# EAGLE design headstage-64-coax-adapter (EAGLE 8.3.2)
DESIGNER: Jon Newman; DESIGN_NAME: Headstage-64 Coax Adapter; LICENSE: CERN OHL v1.2; REVISION: 1.1
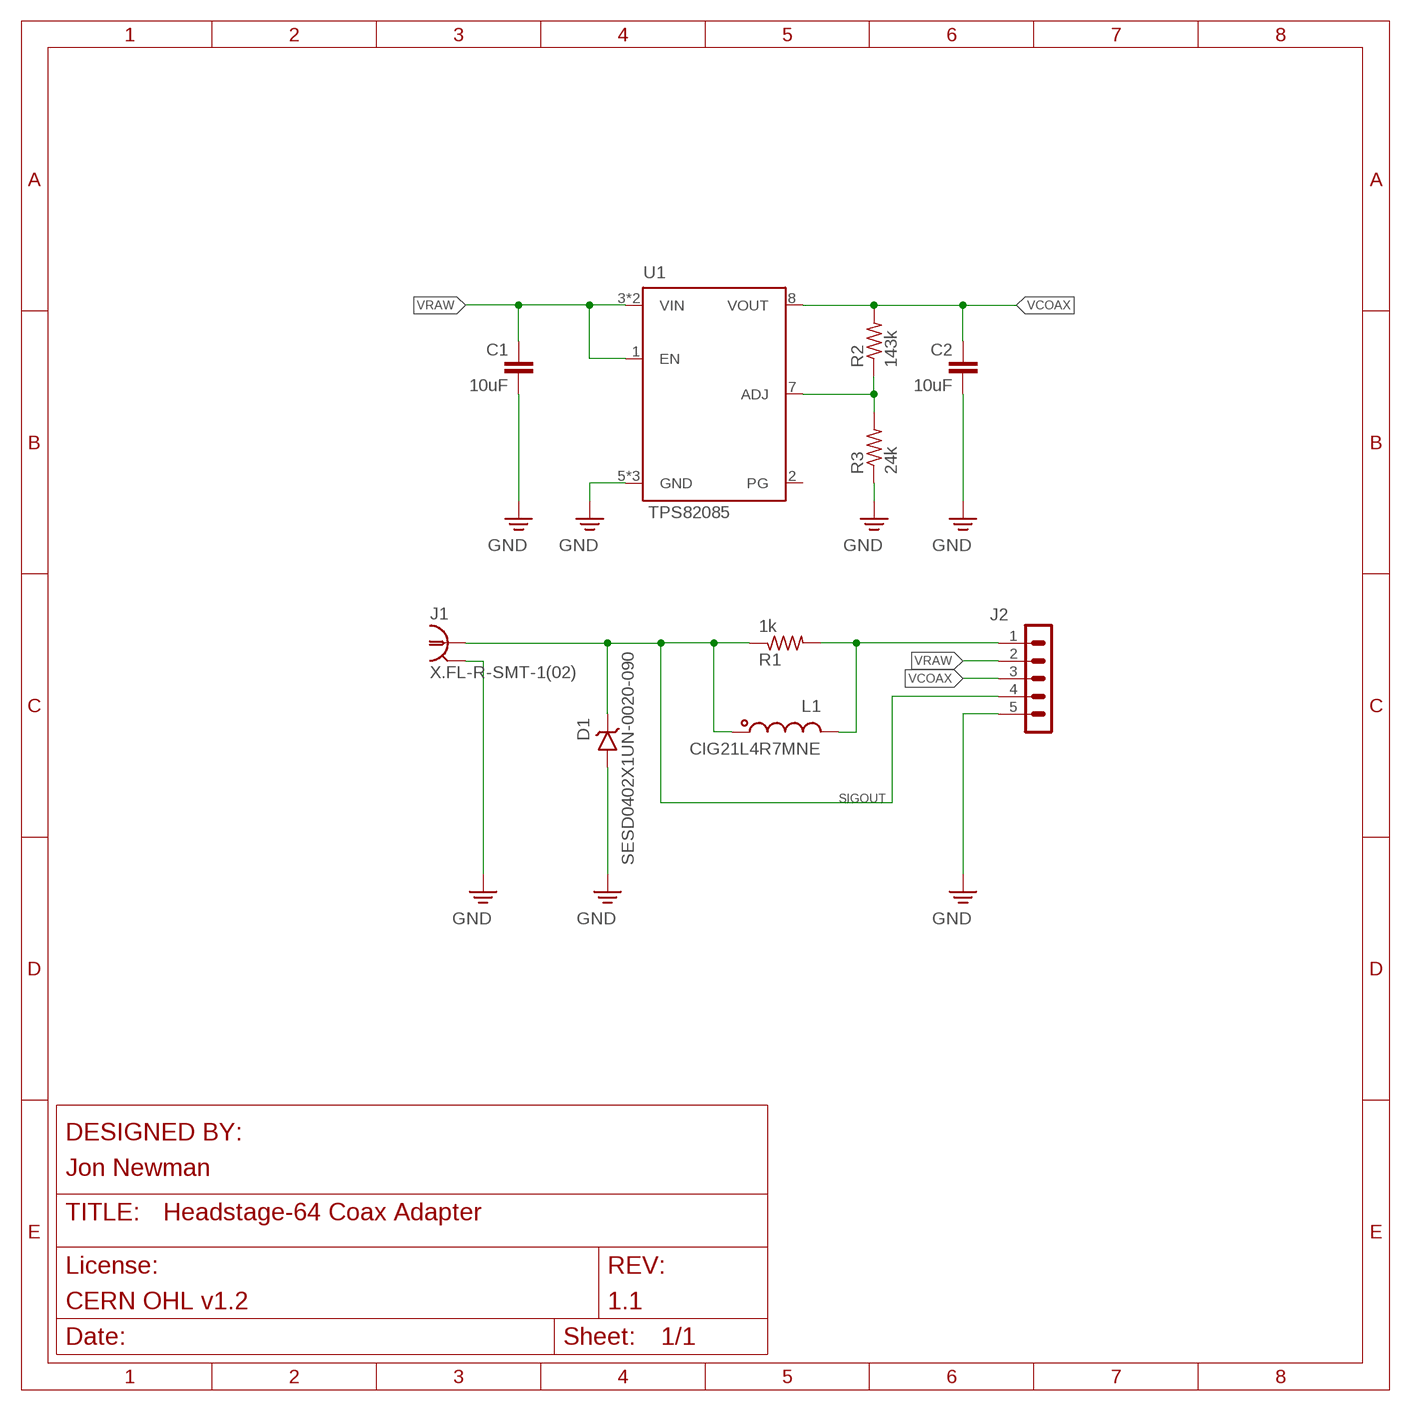
[diagram p0: schematic, sheet 1]

## Parts
C1  10uF  C_0402T  [0402T]
C2  10uF  C_0402T  [0402T]
D1  SESD0402X1UN-0020-090  Z-DIODE_0402T-DFN  [0402T-DFN]
J1  X.FL-R-SMT-1(02)  COAX_XFL  [X_FL_R_SMT_1(02)]
J2  PINHD-1X5_HEADSTAGE-64-REV1.4-DAUGHTER-CARD-CASTELLATED  [HEADSTAGE-64-REV1.4-DAUGHTER-CARD-CASTELLATED]
L1  CIG21L4R7MNE  L_0805T  [0805T]
R1  1k  R_0201T  [0201T]
R2  143k  R_0201T  [0201T]
R3  24k  R_0201T  [0201T]
U1  TPS82085  TPS8208X  [MICROSIP9-2.8X3]

## Nets
GND: C1.2 C2.2 D1.A J1.P$2 J1.P$3 J1.P$4 J2.5 R3.1 U1.5(GND) U1.6(GND) U1.PAD(GND)
N$2: R2.1 R3.2 U1.7(ADJ)
N$48: J2.1 L1.2 R1.2
SIGOUT: D1.C J1.P$1 J2.4 L1.1 R1.1
VCOAX: C2.1 J2.3 R2.2 U1.8(VOUT)
VRAW: C1.1 J2.2 U1.1(EN) U1.3(VIN) U1.4(VIN)
Unconnected: U1.2(PG)

## Library data of the parts
C1 C2 = jonnew:C: Capacitor; PARTNO: CL05A475MO5NUNC
D1 = jonnew:Z-DIODE: Zener Diode
J1 = jonnew:COAX: COAX CONNECTOR - Edge mount BNC - Vertical BNC - Vertical SMA - etc
J2 = jonnew:PINHD-1X5
L1 = jonnew:L: Inductor
R1-R3 = jonnew:R: Resistor
U1 = jonnew:TPS8208X

## Board
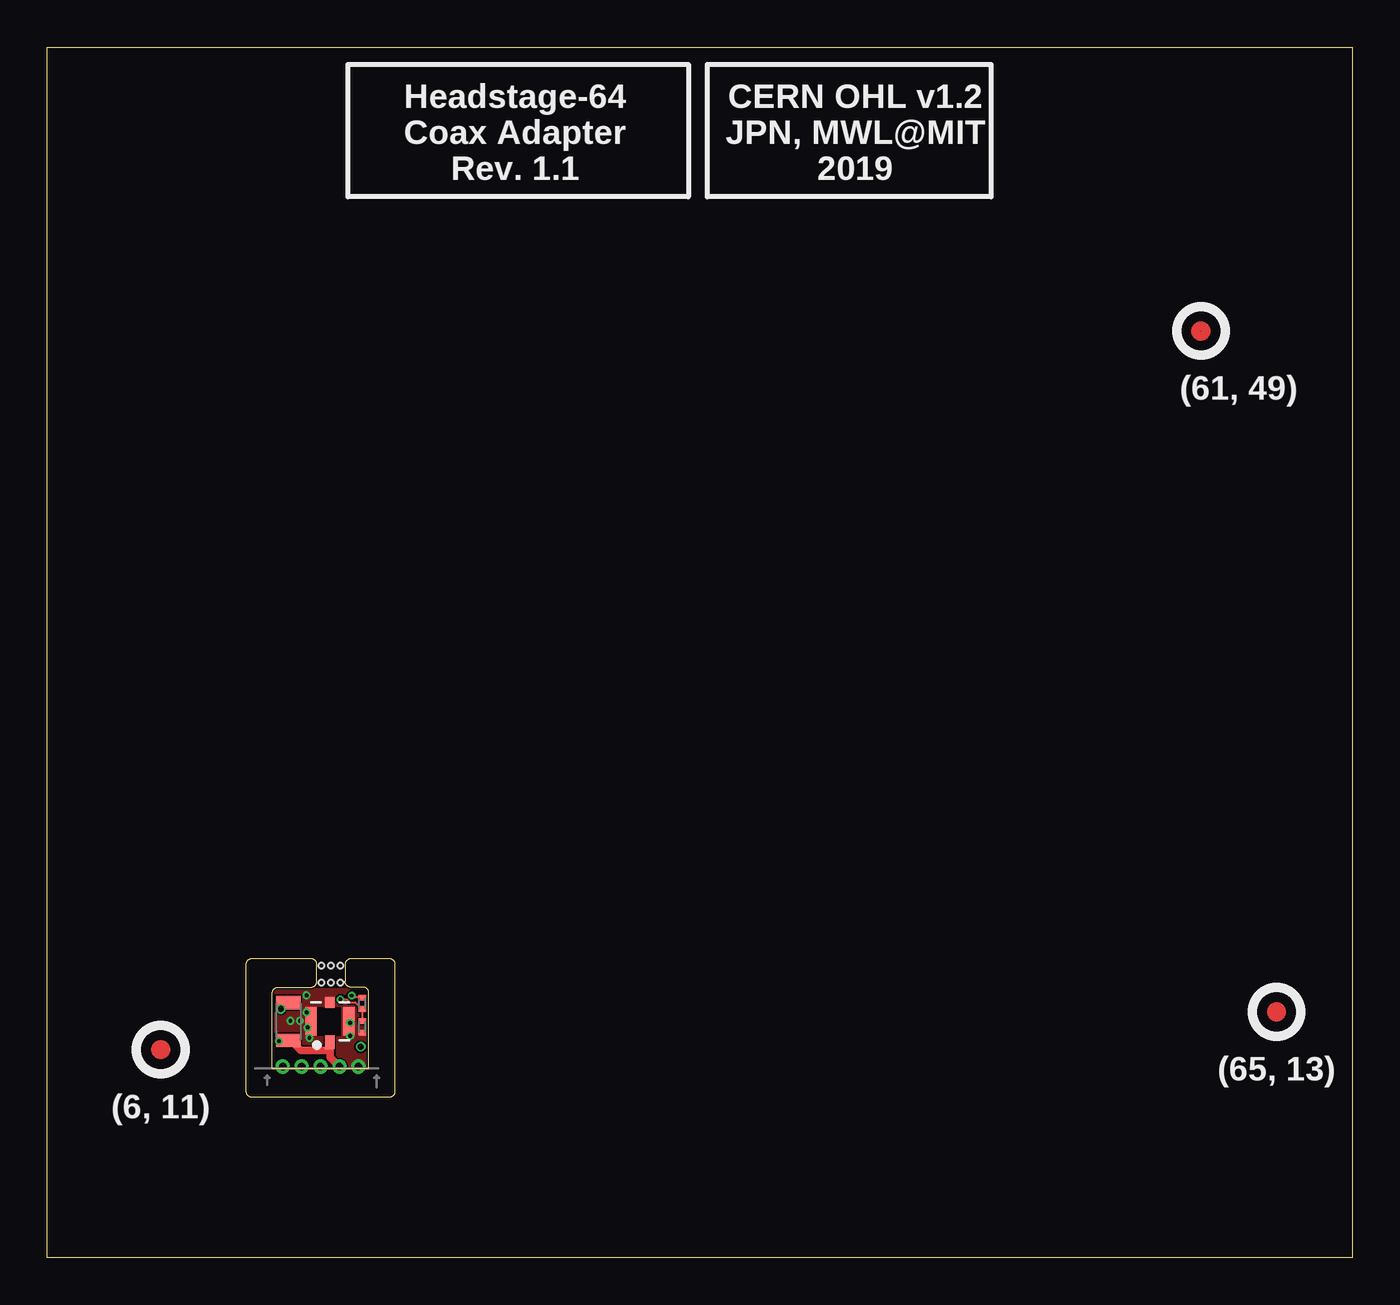
[diagram p1: board, top side]
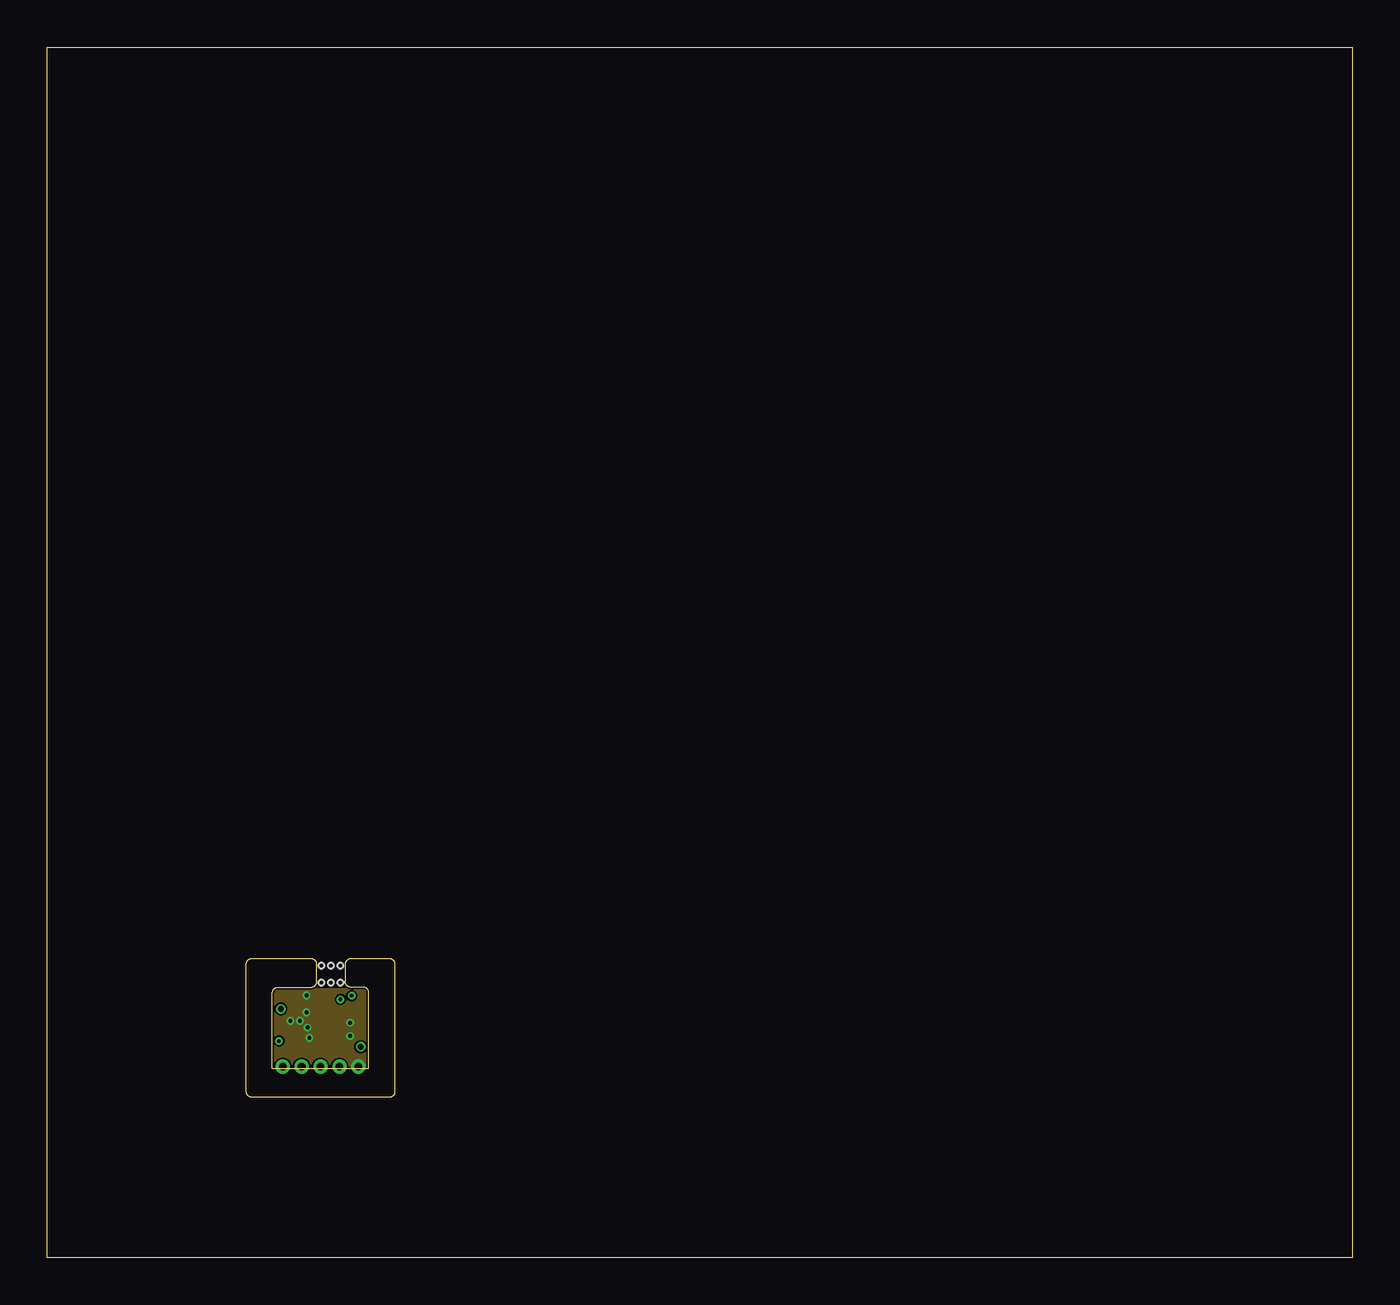
[diagram p2: board, inner layer Route2]
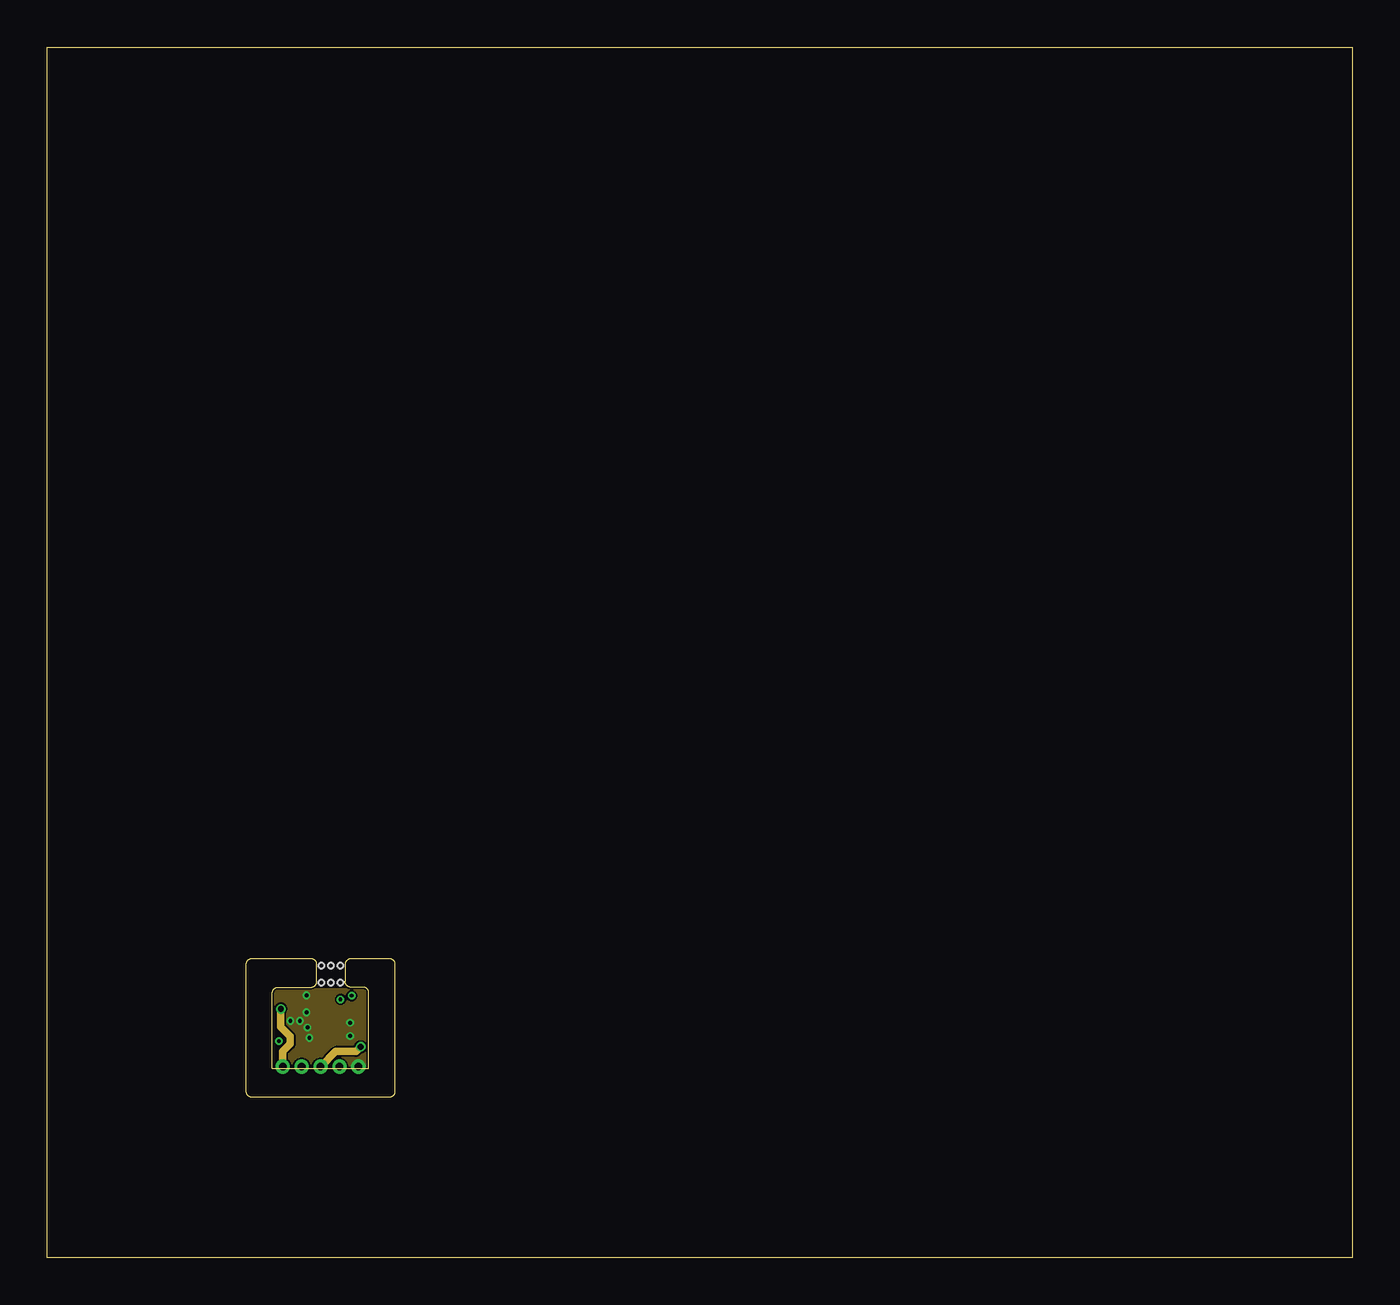
[diagram p3: board, inner layer Route15]
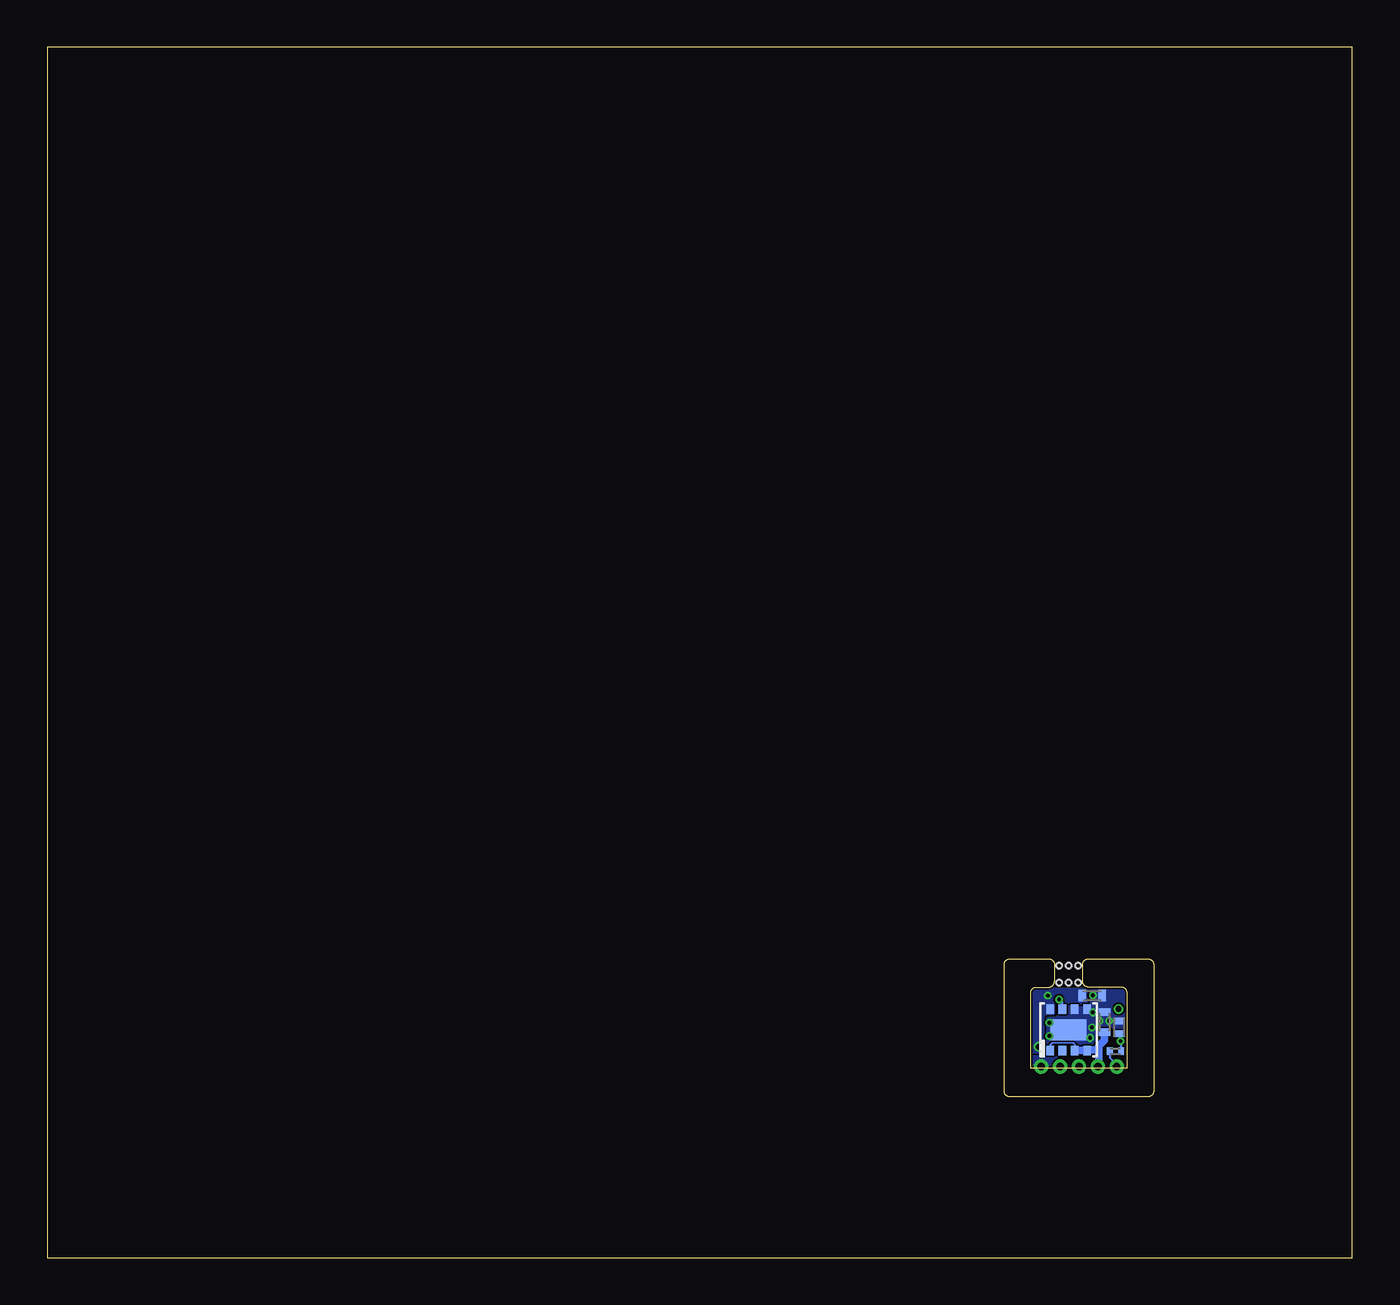
[diagram p4: board, bottom side, seen from below]

Size 69 x 64 mm. Coordinates in mm from the lower left corner, seen from the top.
Outline: 11.9,10 17,10 17,14 arc90 16.7,14.3 16.05,14.3 arc-90 15.75,14.6 15.75,15.5 arc-90 16.05,15.8 18.1,15.8 arc-90 18.4,15.5 18.4,8.8 arc-90 18.1,8.5 10.8,8.5 arc-90 10.5,8.8 10.5,15.5 arc-90 10.8,15.8 13.95,15.8 arc-90 14.25,15.5 14.25,14.6 arc-90 13.95,14.3 12.2,14.3 arc90 11.9,14 11.9,10
Outline: 0,0 0,64 69,64 69,0 0,0
Copper layers (1+2*15+16): Top 0.035mm / dielectric 0.2mm / Route2 0.0175mm / dielectric 1.065mm / Route15 0.0175mm / dielectric 0.2mm / Bottom 0.035mm
Design rules "jlcpcb-4-layer_JLC7628-stackup *": minimum track width 3.5mil, minimum drill 0.2mm, track to track 3.5mil, track to pad 3.5mil, pad to pad 3.5mil, via to via 3.5mil, smd to smd 0mil, copper to edge 0.1mm, drill to drill 3.5mil, minimum pad ring 4mil, minimum via ring 4mil, stop-mask expansion 1mil, vias tented up to drill 100mil, thermal gap 10mil
Holes 0.3 mm at 15,15.45 15,14.55 15.5,14.55 14.5,14.55 15.5,15.45 14.5,15.45

### Footprints (pad centres in the part's own frame; a part is rotated, then mirrored left to right if it is on the bottom)
0402T = smd 0.4 x 0.6: 1 -0.533,0; 2 0.533,0
0402T-DFN = smd 0.35 x 0.6: A -0.325,0; C 0.325,0
X_FL_R_SMT_1(02) = smd 0.5 x 0.7: P$1 0,-1.1 | smd 0.6 x 1.5: P$2 -1,0; P$4 1,0 | smd 0.5 x 0.6: P$3 0,1
HEADSTAGE-64-REV1.4-DAUGHTER-CARD-CASTELLATED = drill 0.4 pad 0.75: 1 -2.55,0.1; 2 -1.55,0.1; 3 -0.55,0.1; 4 0.45,0.1; 5 1.45,0.1
0805T = smd 0.7 x 1.3: 1 -1,0; 2 1,0
0201T = smd 0.3 x 0.4: 1 -0.3,0; 2 0.3,0
MICROSIP9-2.8X3 = smd 0.5 x 0.4: 1 -1.1,0.975; 2 -1.1,0.325; 3 -1.1,-0.325; 4 -1.1,-0.975; 5 1.1,-0.325; 6 1.1,-0.975; 7 1.1,0.325; 8 1.1,0.975 | smd 1.1 x 1.9: PAD 0,0

### Placement (x,y rotation side)
C1  13.1,12.45 90 bottom
C2  13.75,13.85 0 bottom
D1  12.32,12.18 270 bottom
E$1  [FIDUCIAL]  65,13 0 top
E$2  [FIDUCIAL]  61,49 0 top
E$4  [FIDUCIAL]  6,11 0 top
J1  14.95,12.5 0 top
J2  15,10 0 top
L1  12.75,12.49 90 top
R1  12.52,10.91 180 bottom
R2  16.65,13.45 90 top
R3  16.65,12.2 90 top
U1  15,12.05 90 bottom

### Tracks (layer width: path | path; a pad name or v marks a point on that pad's centre or on a via)
GND  (via drill 0.2)
  other vias: 13.36,12.52 13.76,12.17 16.01,12.42 12.86,12.52 13.71,12.97 13.86,11.62 16.01,11.72 13.71,13.87
  pour Bottom (isolate 0.02, rank 2, no thermals): 11.9,14.3 14,14.3 14.1,14.2 15.9,14.2 16,14.3 17,14.3 17,10 11.9,10
  pour Route15 (isolate 0.02, rank 2, no thermals): 11.9,14.3 14,14.3 14.1,14.2 15.9,14.2 16,14.3 17,14.3 17,10 11.9,10
  pour Top (isolate 0.02, rank 2, no thermals): 11.9,14.3 14,14.3 14.1,14.2 15.9,14.2 16,14.3 17,14.3 17,10 11.9,10
  pour Route2 (isolate 0.02, rank 2, no thermals): 11.9,14.3 14,14.3 14.1,14.2 15.9,14.2 16,14.3 17,14.3 17,10 11.9,10
N$2  (via drill 0.2)
  Top 0.1: R3.2 R2.1 16.29,13.51 15.96,13.51 15.82,13.65 v15.5,13.65
  Bottom 0.1: U1.7 15.32,13.47 v15.5,13.65
N$48  (via drill 0.3)
  Top 0.4: L1.2 12.69,13.49 v12.35,13.15
  Route15 0.4: v12.35,13.15 12.35,12.2 12.85,11.7 12.85,11.3 12.45,10.9 J2.1
  Bottom 0.1: R1.2 12.82,10.57 12.4,10.15 J2.1
SIGOUT  (via drill 0.2)
  Top 0.127: v12.25,11.45 arc-45 12.41,11.5 12.66,11.5
  Top 0.4: 12.66,11.5 L1.1 12.86,11.49 13.4,10.95 14.95,10.95 | J2.4 14.95,10.6 14.95,10.95 | 14.95,10.95 J1.P$1
  Bottom 0.1: R1.1 12.22,11.42 v12.25,11.45 12.32,11.52 D1.C
VCOAX  (via drill 0.2, 0.3)
  Top 0.1: R2.2 16.2,13.75 v16.1,13.85
  Route15 0.4: J2.3 15.25,10.9 16.33,10.9 v16.57,11.14 v16.57,11.15
  pour Bottom (no thermals): 14,13.45 14,14.3 14.1,14.2 15.9,14.2 16,14.3 17,14.3 17,10.85 16.3,10.85 16.3,12.8 16.2,12.9 15.75,12.9 15.75,13.45
VRAW
  Bottom 0.089: U1.1 15.97,11.23 15.85,11.35 14.75,11.35 14.63,11.23 14.63,10.98
  Bottom 0.127: U1.1 | 14.63,10.98 14.6,10.95
  Bottom 0.4: U1.3 14.6,10.95 U1.4 13.97,11 13.4,11 | J2.2 13.4,10.15 13.4,11 | C1.1 13.1,11.5 13.4,11.2 13.4,11

### Text on the board
tPlace: Headstage-64 / Coax Adapter / Rev. 1.1 | CERN OHL v1.2 / JPN, MWL@MIT / 2019 | (61, 49) | (65, 13) | (6, 11)